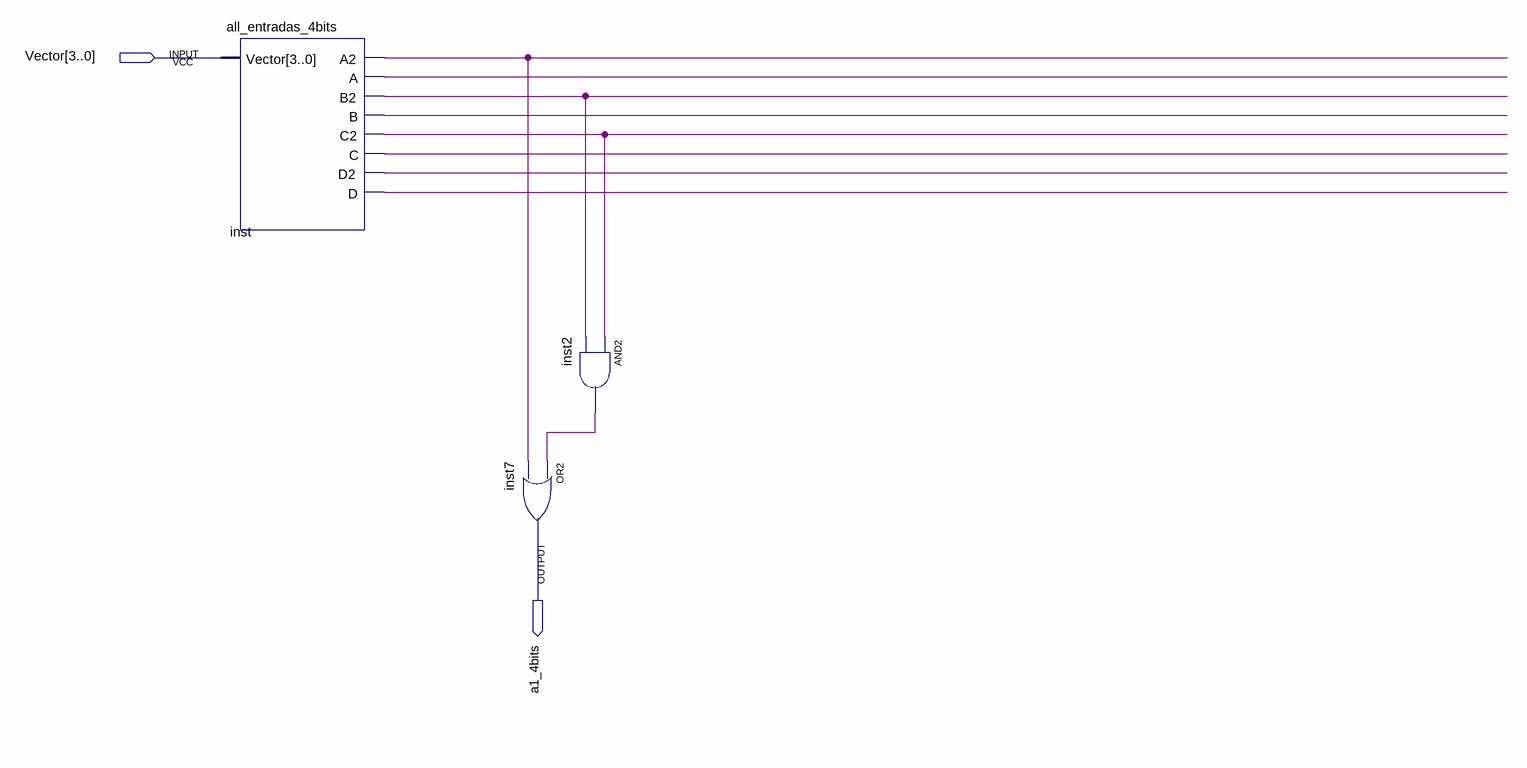
[diagram p0: schematic sheet]
// Quartus schematic a1_4bits.bdf as structural Verilog: 3 symbols, 2 pins
module a1_4bits (
  input  [3:0] Vector,
  output a1_4bits
);

  wire inst2_out, inst_a, inst_a2, inst_b, inst_b2, inst_c, inst_c2, inst_d, inst_d2;

  all_entradas_4bits inst (
    .Vector(Vector), .A2(inst_a2), .A(inst_a), .B2(inst_b2), .B(inst_b), .C2(inst_c2), .C(inst_c),
    .D2(inst_d2), .D(inst_d));
  and inst2 (inst2_out, inst_c2, inst_b2);
  or inst7 (a1_4bits, inst2_out, inst_a2);
endmodule
